# Altium project tsal 2024-25.PrjPcb
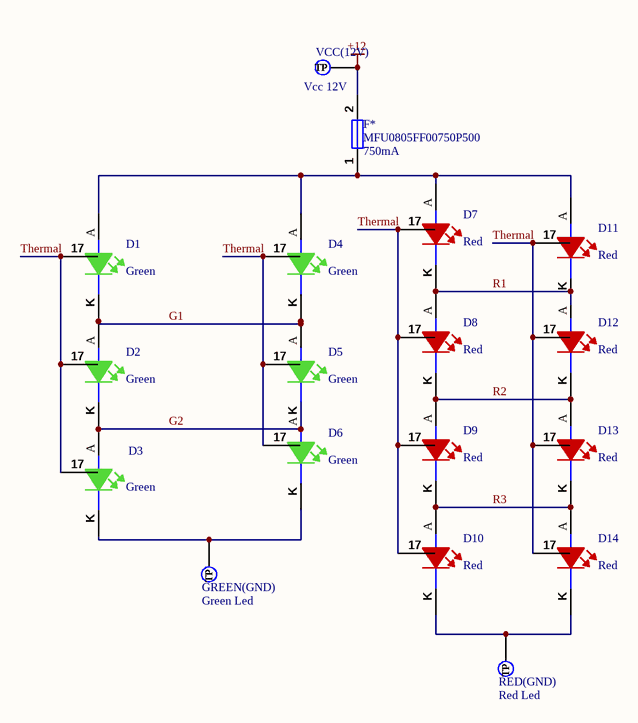
[diagram p0: TSAL 2024-2025.SchDoc]
1 sheet, 19 parts. Net scope: global (net labels, ports and power ports of the same name join across sheets).
Board file: TSAL 2024-25.PcbDoc

## Sheet TSAL 2024-2025.SchDoc
size A4; SheetNumber: 1; SheetTotal: 1

### Parts
?  (no value)  (graphical)
D1  Color: Green  [LED_3535_WE - duplicate]
D2  Color: Green  [LED_3535_WE - duplicate]
D3  Color: Green  [LED_3535_WE - duplicate]
D4  Color: Green  [LED_3535_WE - duplicate]  (hidden comment: LEDGS-3535-85_DUPLICATE)
D5  Color: Green  [LED_3535_WE - duplicate]  (hidden comment: LEDGS-3535-85_DUPLICATE)
D6  Color: Green  [LED_3535_WE - duplicate]  (hidden comment: LEDGS-3535-85_DUPLICATE)
D7  Color: Red  [LED_3535_WE - duplicate]  (hidden comment: LEDRS-3535-55_DUPLICATE)
D8  Color: Red  [LED_3535_WE - duplicate]  (hidden comment: LEDRS-3535-55_DUPLICATE)
D9  Color: Red  [LED_3535_WE - duplicate]  (hidden comment: LEDRS-3535-55_DUPLICATE)
D10  Color: Red  [LED_3535_WE - duplicate]  (hidden comment: LEDRS-3535-55_DUPLICATE)
D11  Color: Red  [LED_3535_WE - duplicate]  (hidden comment: LEDRS-3535-55_DUPLICATE)
D12  Color: Red  [LED_3535_WE - duplicate]  (hidden comment: LEDRS-3535-55_DUPLICATE)
D13  Color: Red  [LED_3535_WE - duplicate]  (hidden comment: LEDRS-3535-55_DUPLICATE)
D14  Color: Red  [LED_3535_WE - duplicate]  (hidden comment: LEDRS-3535-55_DUPLICATE)
F*  MFU0805FF00750P500  Current Rating: 750mA  [0805]
GREEN(GND)  Green Led  [TestPoint]  (no BOM)
RED(GND)  Red Led  [TestPoint]  (no BOM)
VCC(12V)  Vcc 12V  [TestPoint]  (no BOM)

### Nets
+12: F*.2 VCC(12V).1(TP)
G1: D1.K D2.A D4.K D5.A
G2: D2.K D3.A D5.K D6.A
R1: D7.K D8.A D11.K D12.A
R2: D8.K D9.A D12.K D13.A
R3: D9.K D10.A D13.K D14.A
Thermal: D1.17 D2.17 D3.17 D4.17 D5.17 D6.17 D7.17 D8.17 D9.17 D10.17 D11.17 D12.17 D13.17 D14.17
NetD1_A: D1.A D4.A D7.A D11.A F*.1
NetD3_K: D3.K D6.K GREEN(GND).1(TP)
NetD10_K: D10.K D14.K RED(GND).1(TP)

### Notes on the sheet
- Size:
- Company:
- Project:
- Page Contents:
- Variant:
- Version:
- Checked by:
- Author:
- Sheet
- Date:
- Department:
- of

### Library data of the parts
? = CMP-00043-6: Standard Title Block
D1-D6 = CMP-00150-1: High Brightness LED, WL-SMDC Series, 525 nm, Green, 85 lm, 350 mA; Manufacturer: Wurth Electronics; Manufacturer Part Number: 150353GS74500; Forward Voltage: 3.4V; Max Current Rating: 1A; Thermal Resistance of Package: 8°C/W; Test Current: 350mA; .Creator: GP; Wavelength: 525nm; Test Temperature: 25°C; Viewing Angle: 125°; Luminous Flux: 85lm; ComponentLink3Description: Where buy it; Case/Package: SMD/SMT; REACH SVHC: Unknown; Source: Semiconductor.SchLib; ComponentLink2URL: http://www.farnell.com/datasheets/1886832.pdf?src-supplier=Element14; Packaging: Cut Tape; RoHS Compliant: Yes; ComponentLink1Description: http://www.farnell.com/datasheets/1886832.pdf?src-supplier=Farnell; Mount: Surface Mount; Forward Current: 1A; Design Item ID: LEDGS-3535-85_DUPLICATE; ComponentLink2Description: http://www.farnell.com/datasheets/1886832.pdf?src-supplier=Element14; RoHS: Yes; Pricing 1: 1=3,24000, 50=2,85700, 100=2,34700, 500=2,08000 (USD); ComponentLink1URL: http://www.farnell.com/datasheets/1886832.pdf?src-supplier=Farnell; ComponentLink3URL: https://www.we-online.com/catalog/en/WL-SMDC?sq=150353rs74500&sp=https%3A%2F%2Fwww.we-online.com%2Fweb%2Fen%2Fwuerth_elektronik%2Fsearchpage.php%3Fsearch%3D150353rs74500#150353GS74500
D7-D14 = CMP-00152-1: High Brightness Led, Wl-Smdc Series, 625 Nm, Red, 55 Lm, 350 Ma; Manufacturer Part Number: 150353RS74500; Manufacturer: Wurth Electronics; Test Current: 350mA; Luminous Flux: 55lm; .Creator: GP; Wavelength: 625nm; Test Temperature: 25°C; Forward Voltage: 2.2V; Viewing Angle: 125°; Thermal Resistance of Package: 10°C/W; Forward Current: 700mA; RoHS: Yes; ComponentLink3URL: https://www.we-online.com/catalog/en/WL-SMDC?sq=150353rs74500&sp=https%3A%2F%2Fwww.we-online.com%2Fweb%2Fen%2Fwuerth_elektronik%2Fsearchpage.php%3Fsearch%3D150353rs74500#150353RS74500; Packaging: Cut Tape; ComponentLink3Description: Where buy it; ComponentLink2URL: http://www.farnell.com/datasheets/1886833.pdf?src-supplier=Element14; Design Item ID: LEDRS-3535-55_DUPLICATE; Stock 1: 1; RoHS Compliant: Yes; ComponentLink1URL: http://www.farnell.com/datasheets/1886833.pdf?src-supplier=Farnell; REACH SVHC: Unknown; Case/Package: SMD/SMT; ComponentLink2Description: http://www.farnell.com/datasheets/1886833.pdf?src-supplier=Element14; ComponentLink1Description: http://www.farnell.com/datasheets/1886833.pdf?src-supplier=Farnell; Source: Semiconductor.SchLib; Max Current Rating: 700mA; Mount: Surface Mount; Pricing 1: 5=1,40500 (USD)
F* = CMP-005-00000-3: Electric Fuse, Very Fast Blow, 0.75A, 32VDC, 50A (IR), Surface Mount; Max Operating Temperature: 125°C; Min Operating Temperature: -55°C; Mounting Technology: Surface Mount; RoHS Compliant: Yes
GREEN(GND) RED(GND) VCC(12V) = CMP-00042-2: Test Point 1x1 mm; .PCBcheck: GP; Source: e-Tech_Racing.SchLib; Design Item ID: TestPoint; .Creator: GP; Category: TestPoint; .SCHcheck: GP